# Altium schematic sheet subckt_LNA_HMC8410.SchDoc: LNA HMC8410
size A3; DocumentNumber: 12; Revision: 0; SheetNumber: 12; SheetTotal: 19
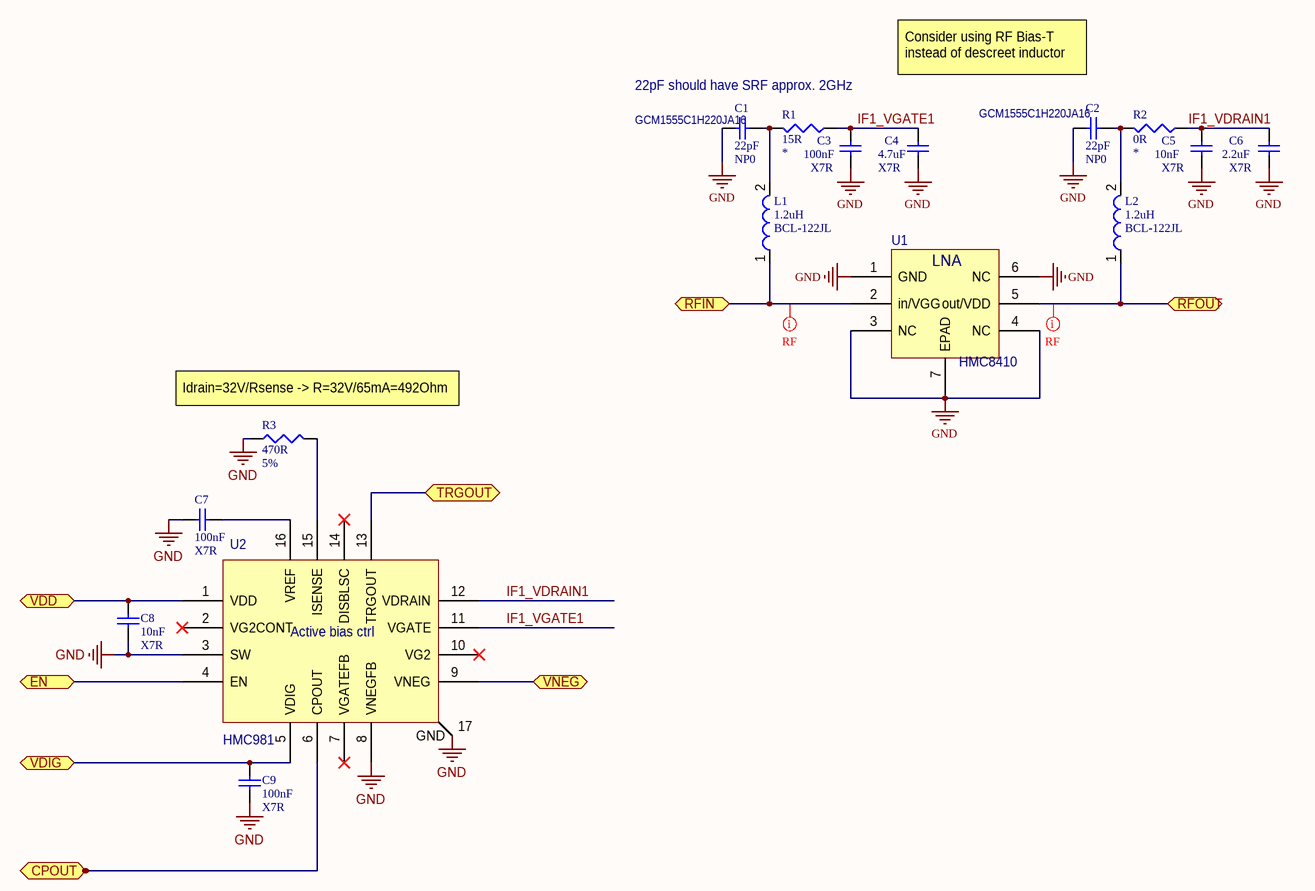
[diagram p0: subckt_LNA_HMC8410.SchDoc]

## Parts
C1  value 22pF  Dielectric: NP0  Model: GCM1555C1H220JA16  [CAP0402]  (hidden comment: Capacitor)
C2  value 22pF  Dielectric: NP0  Model: GCM1555C1H220JA16  [CAP0402]  (hidden comment: Capacitor)
C3  value 100nF  Dielectric: X7R  [CAP0603]  (hidden comment: Capacitor)
C4  value 4.7uF  Dielectric: X7R  [CAP0603]  (hidden comment: Capacitor)
C5  value 10nF  Dielectric: X7R  [CAP0603]  (hidden comment: Capacitor)
C6  value 2.2uF  Dielectric: X7R  [CAP0603]  (hidden comment: Capacitor)
C7  value 100nF  Dielectric: X7R  [CAP0603]  (hidden comment: Capacitor)
C8  value 10nF  Dielectric: X7R  [CAP0603]  (hidden comment: Capacitor)
C9  value 100nF  Dielectric: X7R  [CAP0603]  (hidden comment: Capacitor)
L1  value 1.2uH  Model: BCL-122JL  [Coilcraft_BCL-122]  (hidden comment: Inductor)
L2  value 1.2uH  Model: BCL-122JL  [Coilcraft_BCL-122]  (hidden comment: Inductor)
R1  value 15R  [RES0603]  (hidden comment: Resistor)
R2  value 0R  [RES0603]  (hidden comment: Resistor)
R3  value 470R  Type: 5%  [RES0603]  (hidden comment: Resistor)
U1  HMC8410
U2  HMC981

## Ports
CPOUT, EN, RFIN, RFOUT, TRGOUT, VDD, VDIG, VNEG

## Nets
GND: C1.2 C2.1 C3.1 C4.1 C5.1 C6.1 C7.1 C8.1 C9.1 R3.1 U1.1(GND) U1.3(NC) U1.4(NC) U1.6(NC) U1.7(EPAD) U2.3(SW) U2.8(VNEGFB) U2.17(GND)
CPOUT: U2.6(CPOUT) ; port CPOUT
EN: U2.4(EN) ; port EN
IF1_VDRAIN1: C5.2 C6.2 R2.1 U2.12(VDRAIN)
IF1_VGATE1: C3.2 C4.2 R1.1 U2.11(VGATE)
RFIN: L1.1 U1.2(in/VGG) ; port RFIN
RFOUT: L2.1 U1.5(out/VDD) ; port RFOUT
TRGOUT: U2.13(TRGOUT) ; port TRGOUT
VDD: C8.2 U2.1(VDD) ; port VDD
VDIG: C9.2 U2.5(VDIG) ; port VDIG
VNEG: U2.9(VNEG) ; port VNEG
NetC1_1: C1.1 L1.2 R1.2
NetC2_2: C2.2 L2.2 R2.2
NetC7_2: C7.2 U2.16(VREF)
NetR3_2: R3.2 U2.15(ISENSE)

Not connected (* = marked no-connect by the designer): U2 2(VG2CONT)* 7(VGATEFB)* 10(VG2)* 14(DISBLSC)*

## Layout directives
net class RF: RFIN, RFOUT

## Notes on the sheet
- 22pF should have SRF approx. 2GHz
- Consider using RF Bias-T instead of descreet inductor
- (near R3) Idrain=32V/Rsense -> R=32V/65mA=492Ohm
- (in symbol AD_HMC981LP3E) Active bias ctrl
- (in symbol AD_HMC8410) LNA

## Library data of the parts
U1 = AD_HMC8410: 0.01GHz-10GHz LNA
U2 = AD_HMC981LP3E: HMC981LP3E active bias controller for LNA's w/ external Vgg control
R1-R3 = Resistor
  R1 R2: Type: *